# EAGLE design CAN2 (EAGLE 7.2.0)
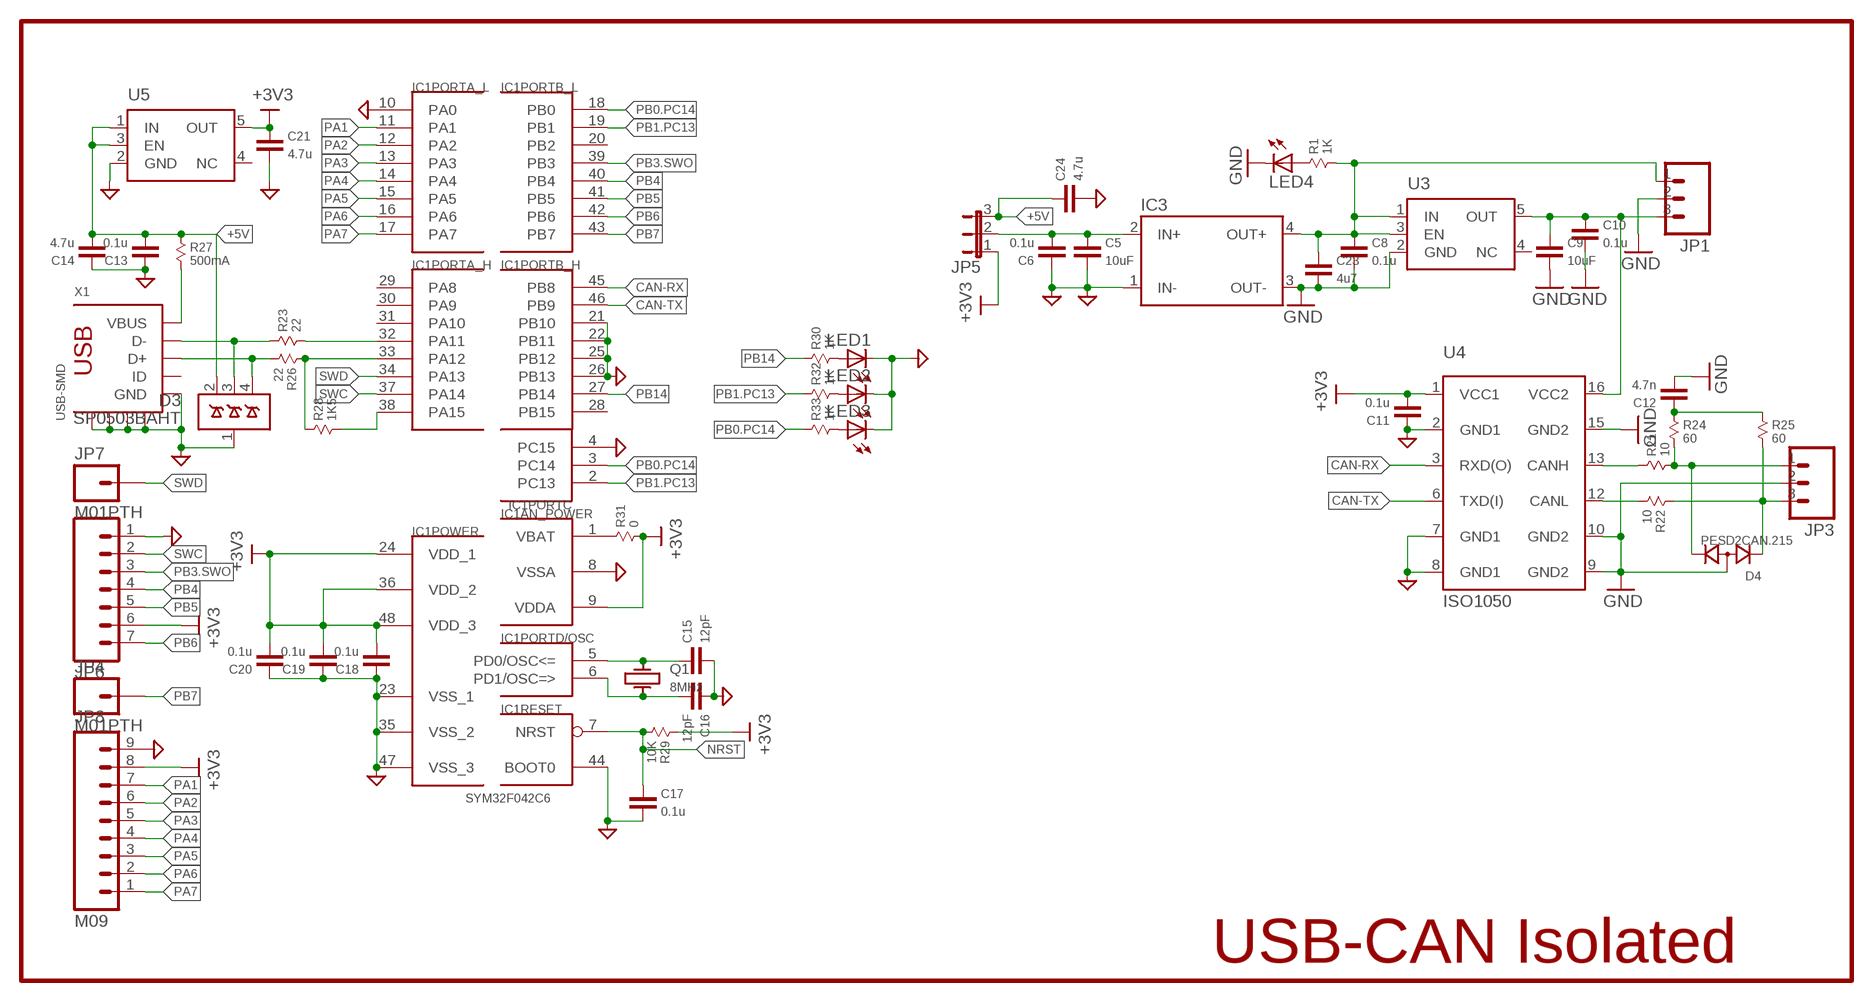
[diagram p0: schematic, sheet 1]

## Parts
C5  10uF  CAP-0805  [0805]
C6  0.1u  CAP-0603  [0603]
C8  0.1u  CAP-0603  [0603]
C9  10uF  CAP-0603  [0603]
C10  0.1u  CAP-0603  [0603]
C11  0.1u  CAP-0603  [0603]
C12  4.7n  CAP-0603  [0603]
C13  0.1u  CAP-0603  [0603]
C14  4.7u  CAP-0603  [0603]
C15  12pF  CAP-0603  [0603]
C16  12pF  CAP-0603  [0603]
C17  0.1u  CAP-0603  [0603]
C18  0.1u  CAP-0603  [0603]
C19  0.1u  CAP-0603  [0603]
C20  0.1u  CAP-0603  [0603]
C21  4.7u  CAP-0603  [0603]
C23  4u7  CAP-0603  [0603]
C24  4.7u  CAP-0603  [0603]
D3  SP0503BAHT  [SOT143]
D4  PESD2CAN.215  DIODE-2A-SOT23  [SOT-23]
IC1  SYM32F042C6  STM32F10XCXT6  [TQFP48]
IC3  DC/DC-RI  [RECOM_SIP4_RI]
JP1  M03PTH  [1X03]
JP3  M03PTH  [1X03]
JP4  M01PTH  [1X01]
JP5  JUMPER-3-1.27  [JUMPER-3-1.27]
JP6  M07  [1X07]
JP7  M01PTH  [1X01]
JP8  M09  [1X09]
LED1  LEDCHIPLED_0603  [CHIPLED_0603]
LED2  LEDCHIPLED_0603  [CHIPLED_0603]
LED3  LEDCHIPLED_0603  [CHIPLED_0603]
LED4  LEDCHIPLED_0603  [CHIPLED_0603]
Q1  8MHz  CRYSTAL-KX-9A  [KX-9A]
R1  1K  RESISTOR-0603  [0603]
R21  10  RESISTOR-0603  [0603]
R22  10  RESISTOR-0603  [0603]
R23  22  RESISTOR-0603  [0603]
R24  60  RESISTOR-0603  [0603]
R25  60  RESISTOR-0603  [0603]
R26  22  RESISTOR-0603  [0603]
R27  500mA  RESISTOR-0805  [0805]
R28  1K5  RESISTOR-0603  [0603]
R29  10K  RESISTOR-0603  [0603]
R30  1K  RESISTOR-0603  [0603]
R31  0  RESISTOR-0603  [0603]
R32  1K  RESISTOR-0603  [0603]
R33  1K  RESISTOR-0603  [0603]
U3  TPS73033  [SOT23-5]
U4  ISO1050  [SOIC16-208]
U5  TPS73033  [SOT23-5]
X1  USB-SMD  [USB-MINIB]

## Nets
+3V3: C11.1 C18.1 C19.1 C20.1 C21.2 IC1.9(AN_POWER:VDDA) IC1.24(POWER:VDD_1) IC1.36(POWER:VDD_2) IC1.48(POWER:VDD_3) JP5.1 JP6.6 JP8.8 R29.1 R31.2 U4.1(VCC1) U5.5(OUT)
+5V: C13.1 C14.1 C24.2 D3.2(D1) JP5.3 R27.1 U5.1(IN) U5.3(EN)
CAN-H: D4.1 JP3.1 R21.2 R24.2
CAN-L: D4.2 JP3.3 R22.1 R25.2
CAN-RX: IC1.45(PORTB_H:PB8) U4.3(RXD(O))
CAN-TX: IC1.46(PORTB_H:PB9) U4.6(TXD(I))
GND: JP6.1
GNDA: C8.1 C9.1 C10.1 C12.1 C23.1 D4.3 IC3.3(OUT-) JP1.2 JP3.2 LED4.C U3.2(GND) U4.9(GND2) U4.10(GND2) U4.15(GND2) ; supply symbol labelled GND
GNDD: C5.1 C6.2 C11.2 C13.2 C14.2 C15.1 C16.2 C17.1 C18.2 C19.2 C20.2 C21.1 C24.1 D3.1(GND) IC1.4(PORTC:PC15) IC1.8(AN_POWER:VSSA) IC1.10(PORTA_L:PA0) IC1.21(PORTB_H:PB10) IC1.22(PORTB_H:PB11) IC1.23(POWER:VSS_1) IC1.25(PORTB_H:PB12) IC1.26(PORTB_H:PB13) IC1.35(POWER:VSS_2) IC1.44(RESET:BOOT0) IC1.47(POWER:VSS_3) IC3.1(IN-) JP8.9 LED1.C LED2.C LED3.C U4.2(GND1) U4.7(GND1) U4.8(GND1) U5.2(GND) X1.GND X1.GND@1(GND) X1.GND@2(GND) X1.GND@3(GND) X1.GND@4(GND) ; supply symbol labelled GND
N$1: LED4.A R1.1
N$3: C12.2 R24.1 R25.1
N$6: C8.2 C23.2 IC3.4(OUT+) JP1.1 R1.2 U3.1(IN) U3.3(EN)
N$7: IC1.32(PORTA_H:PA11) R23.2
N$8: LED2.A R32.2
N$9: R21.1 U4.13(CANH)
N$10: R22.2 U4.12(CANL)
N$13: LED3.A R33.2
N$14: IC1.33(PORTA_H:PA12) R26.1 R28.1
N$15: D3.4(D3) R26.2 X1.D+
N$16: D3.3(D2) R23.1 X1.D-
N$18: R27.2 X1.VBUS
N$19: LED1.A R30.2
N$23: IC1.38(PORTA_H:PA15) R28.2
N$24: C15.2 IC1.5(PORTD/OSC:PD0/OSC<=) Q1.1
N$25: C16.1 IC1.6(PORTD/OSC:PD1/OSC=>) Q1.3
N$26: IC1.1(AN_POWER:VBAT) R31.1
NRST: C17.2 IC1.7(RESET:NRST) R29.2
PA1: IC1.11(PORTA_L:PA1) JP8.7
PA2: IC1.12(PORTA_L:PA2) JP8.6
PA3: IC1.13(PORTA_L:PA3) JP8.5
PA4: IC1.14(PORTA_L:PA4) JP8.4
PA5: IC1.15(PORTA_L:PA5) JP8.3
PA6: IC1.16(PORTA_L:PA6) JP8.2
PA7: IC1.17(PORTA_L:PA7) JP8.1
PB0.PC14: IC1.3(PORTC:PC14) IC1.18(PORTB_L:PB0) R33.1
PB1.PC13: IC1.2(PORTC:PC13) IC1.19(PORTB_L:PB1) R32.1
PB3.SWO: IC1.39(PORTB_L:PB3) JP6.3
PB4: IC1.40(PORTB_L:PB4) JP6.4
PB5: IC1.41(PORTB_L:PB5) JP6.5
PB6: IC1.42(PORTB_L:PB6) JP6.7
PB7: IC1.43(PORTB_L:PB7) JP4.1
PB14: IC1.27(PORTB_H:PB14) R30.1
SWC: IC1.37(PORTA_H:PA14) JP6.2
SWD: IC1.34(PORTA_H:PA13) JP7.1
VCC1: C5.2 C6.1 IC3.2(IN+) JP5.2
VCC2: C9.2 C10.2 JP1.3 U3.5(OUT) U4.16(VCC2)
Unconnected: IC1.20(PORTB_L:PB2) IC1.28(PORTB_H:PB15) IC1.29(PORTA_H:PA8) IC1.30(PORTA_H:PA9) IC1.31(PORTA_H:PA10) U3.4(NC) U5.4(NC) X1.ID

## Notes on the sheet
- USB-CAN Isolated

## Library data of the parts
C5 C6 C8-C21 C23 C24 = X893:CAP: Capacitor
D3 = X893:SP0503BAHT: Surface Mount TVS Avalanche Diode Array (5V) http://www.littelfuse.com/data/en/Data_Sheets/SP05xxBA.pdf
D4 = X893:DIODE-2A: http://www.nxp.com/documents/data_sheet/BAT54W.pdf
IC1 = stm32:STM32F10XCXT6: ST STM32F101/103 48pin LQFP
IC3 = we-power:DC/DC: DC/DC Converter from Meanwell and Recom
JP1 JP3 = SparkFun:M03: Header 3 Standard 3-pin 0.1" header. Use with straight break away headers (SKU : PRT-00116), right angle break away headers (PRT-00553), swiss pins (PRT-00743), machine pins (PRT-00117), and female headers (PRT-00115). Molex polarized connector foot print use with SKU : PRT-08232 with associated crimp pins and housings.
JP4 JP7 = SparkFun:M01: Header 1 Standard 1-pin 0.1" header. Use with straight break away headers (SKU : PRT-00116), right angle break away headers (PRT-00553), swiss pins (PRT-00743), machine pins (PRT-00117), and female headers (PRT-00115).
JP5 = X893:JUMPER-3
JP6 = SparkFun:M07: Header 7 Standard 7-pin 0.1" header. Use with straight break away headers (SKU : PRT-00116), right angle break away headers (PRT-00553), swiss pins (PRT-00743), machine pins (PRT-00117), and female headers (PRT-00115). NOTES ON THE VARIANTS LOCK and LOCK_LONGPADS... This footprint was designed to help hold the alignment of a through-hole component (i.e. 7-pin header) while soldering it into place. You may notice that each hole has been shifted either up or down by 0.005 of an inch from it's more standard position (which is usually a perfectly straight line). This slight alteration caused the pins (the squares in the middle) to touch the edges of the holes. Because they are alternating, it causes a "brace" to hold the header in place. 0.005 has proven to be the perfect amount of "off-center" position when using our standard breakaway headers. Although looks a little odd when you look at the bare footprint, once you have a header in there, the alteration is very hard to notice. Also, if you push a header all the way into place, it is covered up entirely on the bottom side. This idea of altering the position of holes to aid alignment will be further integrated into the Sparkfun Library for other footprints. It can help hold any component with 3 or more connection pins.
JP8 = SparkFun:M09: Header 9 Standard 9-pin 0.1" header. Use with straight break away headers (SKU : PRT-00116), right angle break away headers (PRT-00553), swiss pins (PRT-00743), machine pins (PRT-00117), and female headers (PRT-00115).
LED1-LED4 = led:LED: LED OSRAM: - CHIPLED LG R971, LG N971, LY N971, LG Q971, LY Q971, LO R971, LY R971 LH N974, LH R974 LS Q976, LO Q976, LY Q976 LO Q996 - Hyper CHIPLED LW Q18S LB Q993, LB Q99A, LB R99A - SideLED LS A670, LO A670, LY A670, LG A670, LP A670 LB A673, LV A673, LT A673, LW A673 LH A674 LY A675 LS A676, LA A676, LO A676, LY A676, LW A676 LS A679, LY A679, LG A679 - Hyper Micro SIDELED® LS Y876, LA Y876, LO Y876, LY Y876 LT Y87S - SmartLED LW L88C, LW L88S LB L89C, LB L89S, LG L890 LS L89K, LO L89K, LY L89K LS L896, LA L896, LO L896, LY L896 - TOPLED LS T670, LO T670, LY T670, LG T670, LP T670 LSG T670, LSP T670, LSY T670, LOP T670, LYG T670 LG T671, LOG T671, LSG T671 LB T673, LV T673, LT T673, LW T673 LH T674 LS T676, LA T676, LO T676, LY T676, LB T676, LH T676, LSB T676, LW T676 LB T67C, LV T67C, LT T67C, LS T67K, LO T67K, LY T67K, LW E67C LS E67B, LA E67B, LO E67B, LY E67B, LB E67C, LV E67C, LT E67C LW T67C LS T679, LY T679, LG T679 LS T770, LO T770, LY T770, LG T770, LP T770 LB T773, LV T773, LT T773, LW T773 LH T774 LS E675, LA E675, LY E675, LS T675 LS T776, LA T776, LO T776, LY T776, LB T776 LHGB T686 LT T68C, LB T68C - Hyper Mini TOPLED® LB M676 - Mini TOPLED Santana® LG M470 LS M47K, LO M47K, LY M47K Source: http://www.osram.convergy.de LUXEON: - LUMILED® LXK2-PW12-R00, LXK2-PW12-S00, LXK2-PW14-U00, LXK2-PW14-V00 LXK2-PM12-R00, LXK2-PM12-S00, LXK2-PM14-U00 LXK2-PE12-Q00, LXK2-PE12-R00, LXK2-PE12-S00, LXK2-PE14-T00, LXK2-PE14-U00 LXK2-PB12-K00, LXK2-PB12-L00, LXK2-PB12-M00, LXK2-PB14-N00, LXK2-PB14-P00, LXK2-PB14-Q00 LXK2-PR12-L00, LXK2-PR12-M00, LXK2-PR14-Q00, LXK2-PR14-R00 LXK2-PD12-Q00, LXK2-PD12-R00, LXK2-PD12-S00 LXK2-PH12-R00, LXK2-PH12-S00 LXK2-PL12-P00, LXK2-PL12-Q00, LXK2-PL12-R00 Source: www.luxeon.com KINGBRIGHT: KA-3528ASYC Source: www.kingbright.com
Q1 = X893:CRYSTAL: KX-9A <http://www.kosmodrom.com.ua/pdf/KX-9A.pdf> KX-KT <http://www.kosmodrom.com.ua/pdf/KX-K.pdf>
R1 R21-R33 = X893:RESISTOR
U3 U5 = X893:TPS73033: LOW-NOISE, HIGH PSRR, RF 200-mA LOW-DROPOUT LINEAR REGULATOR http://www.terraelectronica.ru/pdf/TI/TPS73033.pdf
U4 = X893:ISO1050: ISO1050 <http://www.ti.com/lit/ds/symlink/iso1050.pdf>
X1 = X893:USB: USB Connectors USB-B-PTH is fully proven SKU : PRT-00139 USB-miniB is fully proven SKU : PRT-00587 USB-A-PCB is untested. USB-A-H is throughly reviewed, but untested. Spark Fun Electronics SKU : PRT-00437 USB-B-SMT is throughly reviewed, but untested. Needs silkscreen touching up. USB-A-S has not been used/tested USB-MB-H has not been used/tested

## Board
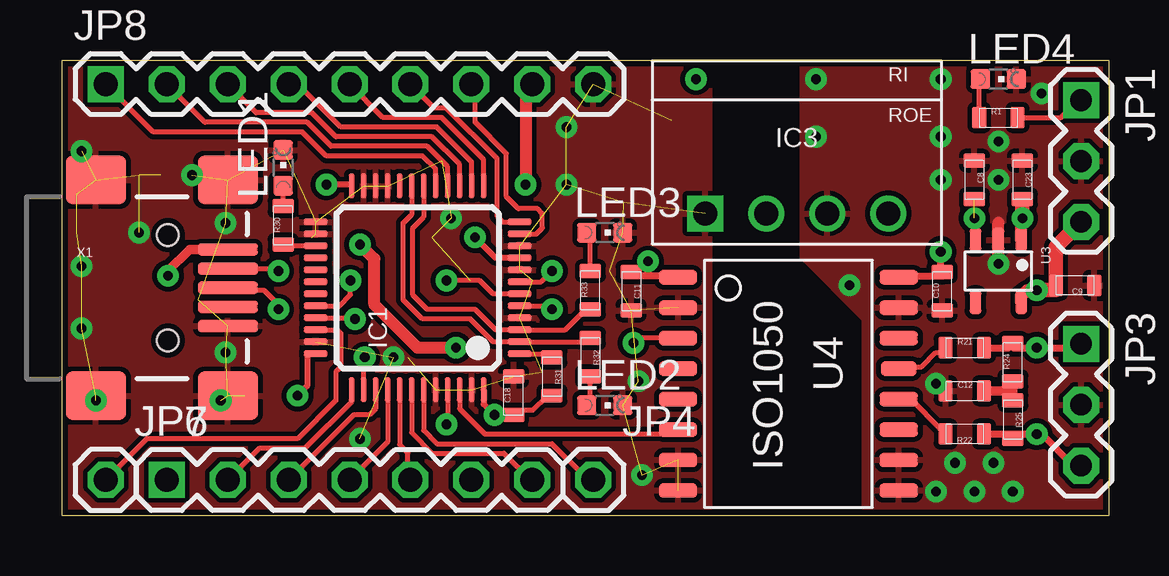
[diagram p1: board, top side]
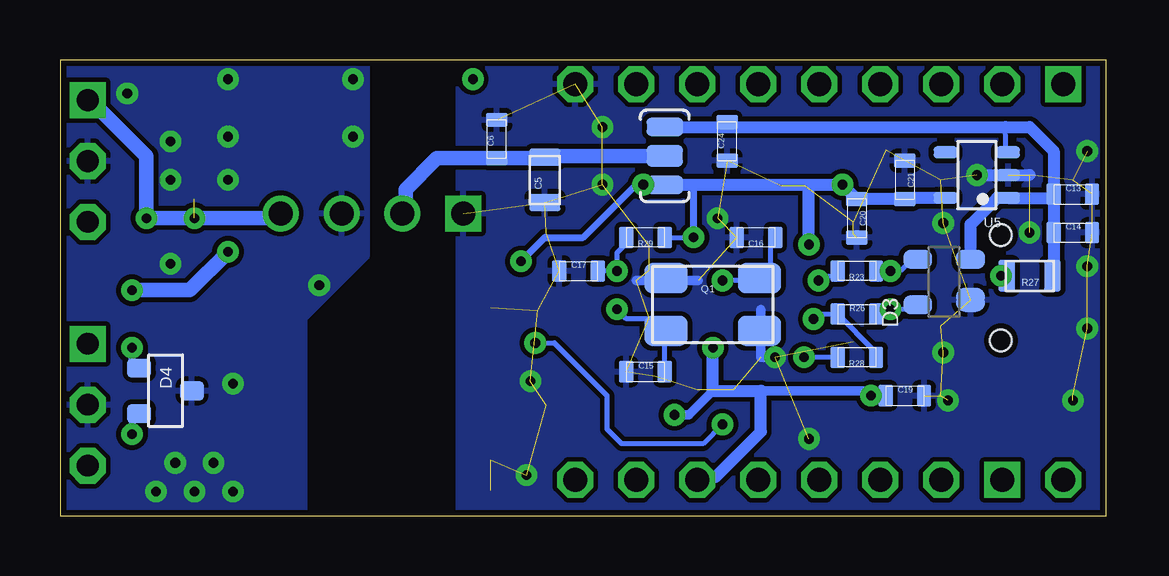
[diagram p2: board, bottom side, seen from below]

Size 43.6 x 19 mm. Coordinates in mm from the lower left corner, seen from the top.
Outline: 0,0 0,19 43.6,19 43.6,0 0,0
Copper layers (1+16): Top 0.035mm / dielectric 1.5mm / Bottom 0.035mm
Design rules "Rezonit": minimum track width 0.2mm, minimum drill 0.4mm, track to track 0.2mm, track to pad 0.2mm, pad to pad 0.2mm, via to via 0.2mm, smd to smd 0mil, copper to edge 0.25mm, drill to drill 0.4mm, minimum pad ring 0.25mm, minimum via ring 0.25mm, stop-mask expansion 4mil, vias tented up to drill 0.4mm, thermal gap 0.2mm

### Footprints (pad centres in the part's own frame; a part is rotated, then mirrored left to right if it is on the bottom)
0805 = smd 0.7 x 1.3: 1 -0.95,0; 2 0.95,0
0603 = smd 0.6 x 0.9: 1 -0.8,0; 2 0.8,0
SOT143 = smd 1 x 1.2: 1 -0.75,-1.1 | smd 0.8 x 1.2: 2 0.95,-1.1; 3 0.95,1.1; 4 -0.95,1.1
SOT-23 = smd 0.8 x 1: 1 -0.95,-1.1; 2 0.95,-1.1; 3 0,1.1
TQFP48 = smd 0.25 x 1: 1 -2.75,-4.25; 2 -2.25,-4.25; 3 -1.75,-4.25; 4 -1.25,-4.25; 5 -0.75,-4.25; 6 -0.25,-4.25; 7 0.25,-4.25; 8 0.75,-4.25; 9 1.25,-4.25; 10 1.75,-4.25; 11 2.25,-4.25; 12 2.75,-4.25; 25 2.75,4.25; 26 2.25,4.25; 27 1.75,4.25; 28 1.25,4.25; 29 0.75,4.25; 30 0.25,4.25; 31 -0.25,4.25; 32 -0.75,4.25; 33 -1.25,4.25; 34 -1.75,4.25; 35 -2.25,4.25; 36 -2.75,4.25 | smd 1 x 0.25: 13 4.25,-2.75; 14 4.25,-2.25; 15 4.25,-1.75; 16 4.25,-1.25; 17 4.25,-0.75; 18 4.25,-0.25; 19 4.25,0.25; 20 4.25,0.75; 21 4.25,1.25; 22 4.25,1.75; 23 4.25,2.25; 24 4.25,2.75; 37 -4.25,2.75; 38 -4.25,2.25; 39 -4.25,1.75; 40 -4.25,1.25; 41 -4.25,0.75; 42 -4.25,0.25; 43 -4.25,-0.25; 44 -4.25,-0.75; 45 -4.25,-1.25; 46 -4.25,-1.75; 47 -4.25,-2.25; 48 -4.25,-2.75
RECOM_SIP4_RI = drill 1 pad 1.5 square: 1 -3.81,0 | drill 1 pad 1.5: 2 -1.27,0; 3 1.27,0; 4 3.81,0
1X03 = drill 0.9 pad 1.5 square: 1 0,0 | drill 0.9 pad 1.5 octagon: 2 2.54,0; 3 5.08,0
1X01 = drill 1 pad 1.5 octagon: 1 0,0
JUMPER-3-1.27 = smd 0.762 x 1.524: 1 -1.206,0; 3 1.206,0 | smd 0.9 x 1.5: 2 0,0
1X07 = drill 1 pad 1.5 square: 1 0,0 | drill 1 pad 1.5 octagon: 2 2.54,0; 3 5.08,0; 4 7.62,0; 5 10.16,0; 6 12.7,0; 7 15.24,0
1X09 = drill 1 pad 1.5 square: 1 0,0 | drill 1 pad 1.5 octagon: 2 2.54,0; 3 5.08,0; 4 7.62,0; 5 10.16,0; 6 12.7,0; 7 15.24,0; 8 17.78,0; 9 20.32,0
CHIPLED_0603 = smd 0.8 x 0.8: A 0,-0.75; C 0,0.75
KX-9A = smd 1.8 x 1.25: 1 -1.95,-1.1; 2 1.95,-1.1; 3 1.95,1.1; 4 -1.95,1.1
SOT23-5 = smd 0.5 x 1: 1 -0.95,-1.3; 2 0,-1.3; 3 0.95,-1.3; 4 0.95,1.3; 5 -0.95,1.3
SOIC16-208 = smd 0.6 x 1.6: 1 -4.445,-4.6; 2 -3.175,-4.6; 3 -1.905,-4.6; 4 -0.635,-4.6; 5 0.635,-4.6; 6 1.905,-4.6; 7 3.175,-4.6; 8 4.445,-4.6; 9 4.445,4.6; 10 3.175,4.6; 11 1.905,4.6; 12 0.635,4.6; 14 -1.905,4.6; 15 -3.175,4.6; 16 -4.445,4.6 | smd 0.6 x 1.5: 13 -0.635,4.6
USB-MINIB = smd 2.5 x 0.5: D+ 2.5,0; D- 2.5,0.8; GND 2.5,-1.6; ID 2.5,-0.8; VBUS 2.5,1.6 | smd 2.5 x 2: GND@1 -3,-4.5; GND@2 -3,4.5; GND@3 2.5,4.5; GND@4 2.5,-4.5 | hole 0.9: 0,2.2; 0,-2.2

### Placement (x,y rotation side)
C5  23.4,14 90 bottom
C6  25.4,15.7 90 bottom
C8  38,14 270 top
C9  42.2,9.6 180 top
C10  36.66,9.36 90 top
C11  23.7,9.36 270 top
C12  37.6,5.2 0 top
C13  1.4,13.4 0 bottom
C14  1.4,11.8 0 bottom
C15  19.2,6 0 bottom
C16  14.6,11.6 180 bottom
C17  22,10.2 0 bottom
C18  18.8,5 90 top
C19  8.4,5 0 bottom
C20  10.4,12.4 270 bottom
C21  8.4,14 270 bottom
C23  40,14 270 top
C24  15.8,15.6 90 bottom
D3  6.76,9.74 90 bottom
D4  39.2,5.2 270 bottom
IC1  14.8,9.5 90 top
IC3  30.6,12.6 0 top
JP1  42.44,17.32 270 top
JP3  42.44,7.16 270 top
JP4  22.12,1.48 0 top
JP5  18.4,15 90 bottom
JP6  4.34,1.48 0 top
JP7  1.8,1.48 0 top
JP8  1.8,17.99 0 top
LED1  9.2,14.5 0 top
LED2  22.6,4.6 270 top
LED3  22.6,11.8 270 top
LED4  39,18.2 270 top
Q1  16.4,8.8 0 bottom
R1  39,16.6 0 top
R21  37.6,7 0 top
R22  37.6,3.4 180 top
R23  10.4,10.2 180 bottom
R24  39.6,6.4 90 top
R25  39.6,4 270 top
R26  10.4,8.4 0 bottom
R27  3.2,10 180 bottom
R28  10.4,6.6 180 bottom
R29  19.2,11.6 180 bottom
R30  9.2,12.1 90 top
R31  20.4,5.8 270 top
R32  22,6.6 270 top
R33  22,9.4 90 top
U3  39,10.2 180 top
U4  30.25,5.49 270 top
U5  5.4,14.2 90 bottom
X1  4.4,9.5 0 top

### Tracks (layer width: path | path; a pad name or v marks a point on that pad's centre or on a via)
+3V3  (via drill 0.4)
  Top 0.2: 20.2,4.95 R31.2 20.2,5 19.6,4.4 19,4.4 C18.1 | IC1.36 10.2,6.75 | IC1.24 12,13.8 | 12.5,11.3 v12.4,11.3
  Top 0.25: 10.2,6.75 10.2,5.4 v9.8,5 | IC1.9 18.05,10.75 v17.2,11.6 | 12,13.8 v11,13.8 | IC1.48 17.55,4.65 v18,4.2
  Top 0.3: U4.1 25.6,10 24.4,10 | 24.4,10 23.73,10 C11.1 | v24.4,10.6 24.4,10
  Top 0.4: C18.1 v18,4.2
  Top 0.5: v16.4,7 14.8,7 13,8.8 13,10.7 v12.4,11.3 | JP8.8 19.3,17.71 v19.3,13.8
  Bottom 0.2: R29.1 v17.2,11.6
  Bottom 0.3: v24.4,10.6 23.4,11.6 21.8,11.6 19.6,13.8 v19.3,13.8 JP5.1 | v17.2,11.6 17.2,13.8
  Bottom 0.4: v18,4.2 17.4,4.2 16.4,5.2 | 14.4,5.2 10,5.2 v9.8,5 C19.1 | JP5.1 | U5.5 6.8,13.25 | 8.35,13.25 C21.2
  Bottom 0.5: JP5.1 17.2,13.8 12.4,13.8 | 12.4,13.8 v11,13.8 C20.1 C21.2 | v16.4,7 16.4,5.2 14.4,5.2 14.4,3.5 16.3,1.6 16.93,1.6 JP6.6 | v12.4,11.3 12.4,13.8 | 6.8,13.25 8.35,13.25
+5V
  Bottom 0.2: U5.3 4.15,15.15 4.2,15.2 4.2,15.59 4.21,16.2
  Bottom 0.25: C24.2 15.8,16.2
  Bottom 0.4: JP5.3 | 4.21,16.2 4.21,16.21 | 2.2,10.15 R27.1 | 2.2,13.45 C13.1
  Bottom 0.5: JP5.3 15.8,16.2 4.21,16.2 3.2,16.2 2.2,15.2 2.2,13.45 | C13.1 2.2,13.25 | 2.2,13.25 C14.1 2.2,10.15 | 2.2,13.25 U5.1 4.55,13.25 5.66,12.14 D3.2
CAN-H  (via drill 0.4)
  Top 0.3: R21.2 38.35,6.95 R21.2 | R21.2 39.45,7 R24.2 39.6,7 v40.6,7 42.41,7 JP3.1
  Bottom 0.3: D4.1 40.3,6.2 40.6,6.2 v40.6,7
CAN-L  (via drill 0.4)
  Top 0.3: R22.1 38.35,3.45 R22.1 | R22.1 39.6,3.4 | 39.6,3.4 v40.6,3.4 40.8,3.4 42.12,2.08 JP3.3 | R25.2 39.6,3.4
  Bottom 0.3: D4.2 40.35,4.25 40.6,4.2 v40.6,3.4
CAN-RX  (via drill 0.4)
  Top 0.2: IC1.45 16.05,3.75 v16,3.8 | U4.3 25.4,7.4 24,7.4 v23.8,7.2
  Bottom 0.2: v16,3.8 16.8,3 20.2,3 20.8,3.6 20.8,5 23,7.2 v23.8,7.2
CAN-TX
  Top 0.2: U4.6 25.69,3.59 25.5,3.4 17.6,3.4 16.55,4.45 IC1.46
GNDA  (via drill 0.4)
  Top 0.5: v39,10.5 39,12.2
  other vias: 36.4,1 36.6,18.2 38,1 39.6,1 38.8,2.2 37.2,2.2 36.4,5.5 40.8,17.6 36.6,15.8 39,15.6 36.6,14 39,14 31.4,18.2 31.4,15.8 26.4,18.2 32.8,9.6
  pour Top (isolate 0.2): 33.4,0 43.6,0 43.6,19 30.8,19 30.8,10.8 33.4,8.2
  pour Bottom (isolate 0.2): 33.4,0 43.6,0 43.6,19 30.8,19 30.8,10.8 33.4,8.2
GNDD  (via drill 0.4)  (55 unrouted)
  Bottom 0.4: v13.8,6.6 14.4,6.6 14.4,8.6 | 19.6,9.8 17,9.8
  Bottom 0.5: v5.4,14.2 3.2,14.2
  other vias: 24,5.6 24.16,1.68 1.4,4.8 6.6,4.8 12.4,3.2 21,16.2 21,13.8 16.2,12.4 0.8,10.4 0.8,7.8 0.8,15.2 6.8,12.2 3.2,11.8 6.8,6.8
  pour Top (isolate 0.2): 0,0 27,0 27,19 0,19
  pour Bottom (isolate 0.2): 0,0 27,0 27,19 0,19
N$1
  Top 0.2: R1.1 38.2,18.15 LED4.A
N$3
  Top 0.4: R24.1 39.6,5.2 | 39.6,5.2 R25.1 | C12.2 39.6,5.2
N$6  (via drill 0.4)  (1 unrouted)
  Top 0.2: U3.3 38,11.55 v38,12.4 | R1.2 41.6,16.6 42,17 42.12,17 JP1.1
  Top 0.5: U3.1 39.95,12.4 v40,12.4
  Top 0.6: C23.2 v40,12.4
  Bottom 0.6: IC3.4 34.41,12.4 v38,12.4 v40,12.4 40,15 42,17 42.12,17 JP1.1
N$7  (via drill 0.4)
  Top 0.2: IC1.32 11.55,8.75 12,9.2 v12,9.8
  Bottom 0.2: v12,9.8 11.8,10 11.2,10 R23.2
N$8
  Top 0.2: LED2.A 22,4.6 R32.2
N$9
  Top 0.2: U4.13 34.85,6.2 35.8,6.2 36.4,6.8 36.8,6.8 R21.1
N$10
  Top 0.2: U4.12 35.34,4.86 36.6,3.6 36.85,3.6 R22.2
N$13
  Top 0.2: 22.05,10.15 R33.2 22,11.75 LED3.A
N$14  (via drill 0.4)
  Top 0.2: IC1.33 12.15,8.25 v12.2,8.2
  Bottom 0.2: v12.2,8.2 12,8.4 R26.1 | R28.1 9.65,6.85 R26.1 | R26.1 11.2,8.35 R26.1
N$15  (via drill 0.4)
  Top 0.2: X1.D+ 7,9.4 8.4,9.4 9,8.8 v9,8.6
  Bottom 0.2: R26.2 9.6,8.6 v9,8.6 7.99,8.59 D3.4
N$16  (via drill 0.4)
  Top 0.2: X1.D- 8.9,10.3 v9,10.2
  Bottom 0.2: R23.1 v9,10.2 8.6,10.2 8.11,10.69 D3.3 | R23.1 9.6,10 R23.1
N$18  (via drill 0.4)
  Top 0.4: X1.VBUS 5.3,11.1 4.4,10.2 v4.4,10
  Bottom 0.2: R27.2 v4.4,10
  Bottom 0.5: 4.2,10.4 R27.2
N$19
  Top 0.2: R30.2 LED1.A
N$23  (via drill 0.4)
  Top 0.2: IC1.38 12.55,6.55 v12.6,6.6
  Bottom 0.2: R28.2 11.2,6.8 R28.2 | R28.2 v12.6,6.6
N$24  (via drill 0.4)
  Top 0.2: IC1.5 20.25,8.75 v20.4,8.6
  Bottom 0.2: C15.2 18.4,7.45 Q1.1 18.4,7.95 18.4,8.2 20,8.2 v20.4,8.6
N$25  (via drill 0.4)
  Top 0.2: IC1.6 17.95,9.25 17.4,9.8 v16,9.8
  Bottom 0.2: v16,9.8 14.2,9.8 14.1,9.9 Q1.3 14,10.15 14,11.6 C16.1
N$26
  Top 0.2: IC1.1 20.2,6.75 R31.1
NRST  (via drill 0.4)
  Top 0.2: IC1.7 19.95,9.75 v20.4,10.2
  Bottom 0.2: C17.2 v20.4,10.2 20.4,10.95 19.95,11.4 R29.2
PA1
  Top 0.2: IC1.11 19.75,11.75 20,12 20,12.6 19.8,12.8 19,12.8 18.5,13.3 18.5,15.1 17.2,16.4 17.2,17.84 JP8.7
PA2
  Top 0.2: JP8.6 15.5,17 16,17 18.1,14.9 18.1,12.5 18.35,12.25 IC1.12
PA3
  Top 0.2: IC1.13 17.55,14.85 15.8,16.6 13.36,16.6 JP8.5
PA4
  Top 0.2: IC1.14 17.05,14.75 15.6,16.2 11.6,16.2 9.81,17.99 JP8.4
PA5
  Top 0.2: IC1.15 16.55,14.65 15.4,15.8 11.4,15.8 10.4,16.8 8.08,16.8 JP8.3
PA6
  Top 0.2: IC1.16 16.05,14.55 15.2,15.4 11.2,15.4 10.2,16.4 5.94,16.4 JP8.2
PA7
  Top 0.2: IC1.17 15.55,14.45 15,15 11,15 10,16 3.8,16 JP8.1
PB0.PC14
  Top 0.2: R33.1 21.8,8.6 20.95,7.75 IC1.3 18.05,7.75 17.2,8.6 15.2,8.6 14.6,9.2 14.6,12 15.05,12.45 IC1.18
PB1.PC13
  Top 0.2: R32.1 21.9,7.25 IC1.2 17.95,7.25 17,8.2 15,8.2 14.2,9 14.2,12.2 14.55,12.55 IC1.19
PB3.SWO
  Top 0.2: IC1.39 13.05,4.45 12.8,4.2 12.14,4.2 JP6.3
PB4
  Top 0.2: IC1.40 13.55,3.07 JP6.4
PB5
  Top 0.2: IC1.41 14.05,2.95 14.4,2.6 14.4,1.59 JP6.5
PB6
  Top 0.2: IC1.42 14.55,3.45 15.4,2.6 18.4,2.6 19.52,1.48 JP6.7
PB7
  Top 0.2: IC1.43 15.05,3.55 15.6,3 20.4,3 21.6,1.8 21.81,1.8 JP4.1
PB14
  Top 0.2: IC1.27 9,11.25 R30.1
SWC
  Top 0.2: IC1.37 12.05,4.75 10.1,2.8 8.2,2.8 7.8,2.4 JP6.2
SWD
  Top 0.2: IC1.34 11.45,7.75 11.6,7.6 11.6,6.2 11.4,6 11.4,4.8 9.8,3.2 3.52,3.2 JP7.1
VCC1
  Bottom 0.6: C5.2 23.45,14.95 | JP5.2 23.4,15 C5.2 | IC3.2 29.2,12.73 29.2,13.6 27.9,14.9 C6.1 23.45,14.9 C5.2
VCC2  (via drill 0.4)
  Top 0.3: U4.16 34.94,9.94 35,10 36.6,10 | 36.6,10 36.75,10 C10.2 36.86,10.06 36.6,10 | 36.6,10 v36.6,11
  Top 0.35: 36.84,10.12 C10.2
  Top 0.5: U3.5 39.95,9.19 40.2,9.39 v40.6,9.4
  Top 0.6: v40.6,9.4 41.4,9.4 C9.2 41.4,11.2 JP1.3
  Bottom 0.6: v40.6,9.4 38.2,9.4 v36.6,11

### Text on the board
Reference: +5V | GND | +3.3V | CAN-H | GND | CAN-L